# EAGLE schematic Servo Header (EAGLE 8.2.1)
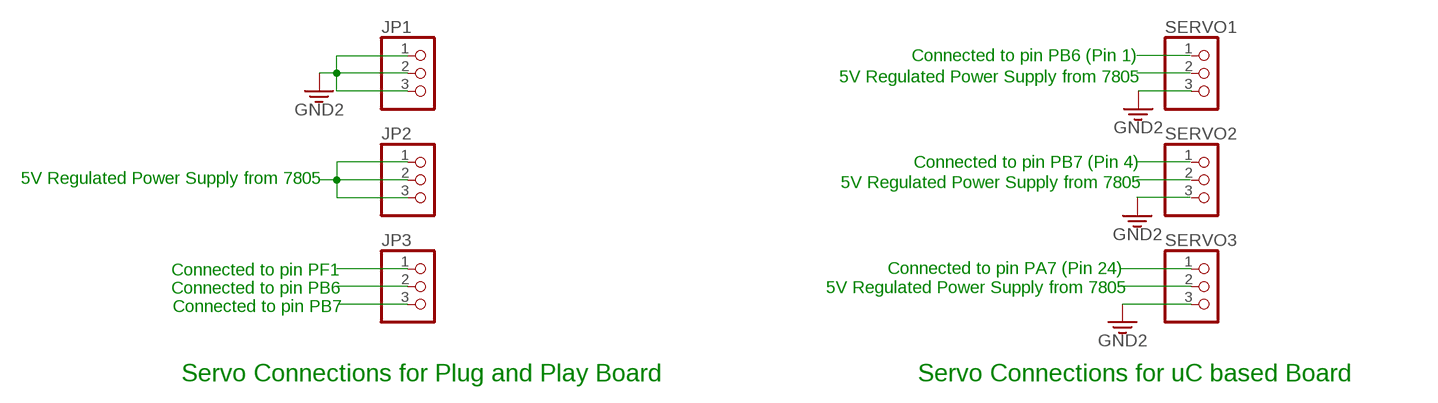
[diagram p0: schematic, sheet 1]

## Parts
JP1  PINHD-1X3  [1X03]
JP2  PINHD-1X3  [1X03]
JP3  PINHD-1X3  [1X03]
SERVO1  PINHD-1X3  [1X03]
SERVO2  PINHD-1X3  [1X03]
SERVO3  PINHD-1X3  [1X03]

## Nets
N$1: JP1.1 JP1.2 JP1.3
N$3: JP2.1 JP2.2 JP2.3
PB1: SERVO3.3
PB2: SERVO3.2
PB6: JP3.2
PB7: JP3.3
PF1: JP3.1
PF2: SERVO3.1
Unconnected: SERVO1.1 SERVO1.2 SERVO1.3 SERVO2.1 SERVO2.2 SERVO2.3

## Notes on the sheet
- Connected to pin PB6 (Pin 1)
- 5V Regulated Power Supply from 7805
- Connected to pin PB7 (Pin 4)
- 5V Regulated Power Supply from 7805 | 5V Regulated Power Supply from 7805
- Connected to pin PF1 | Connected to pin PA7 (Pin 24)
- Connected to pin PB6 | 5V Regulated Power Supply from 7805
- Connected to pin PB7
- Servo Connections for Plug and Play Board | Servo Connections for uC based Board

## Library data of the parts
JP1-JP3 SERVO1-SERVO3 = adafruit:PINHD-1X3: PIN HEADER

## Net classes
0 default: width 0.2 mm, clearance 0.2 mm
1 5V1: width 1 mm, clearance 0.2 mm
3 5V-SERVO: width 1 mm, clearance 0.2 mm